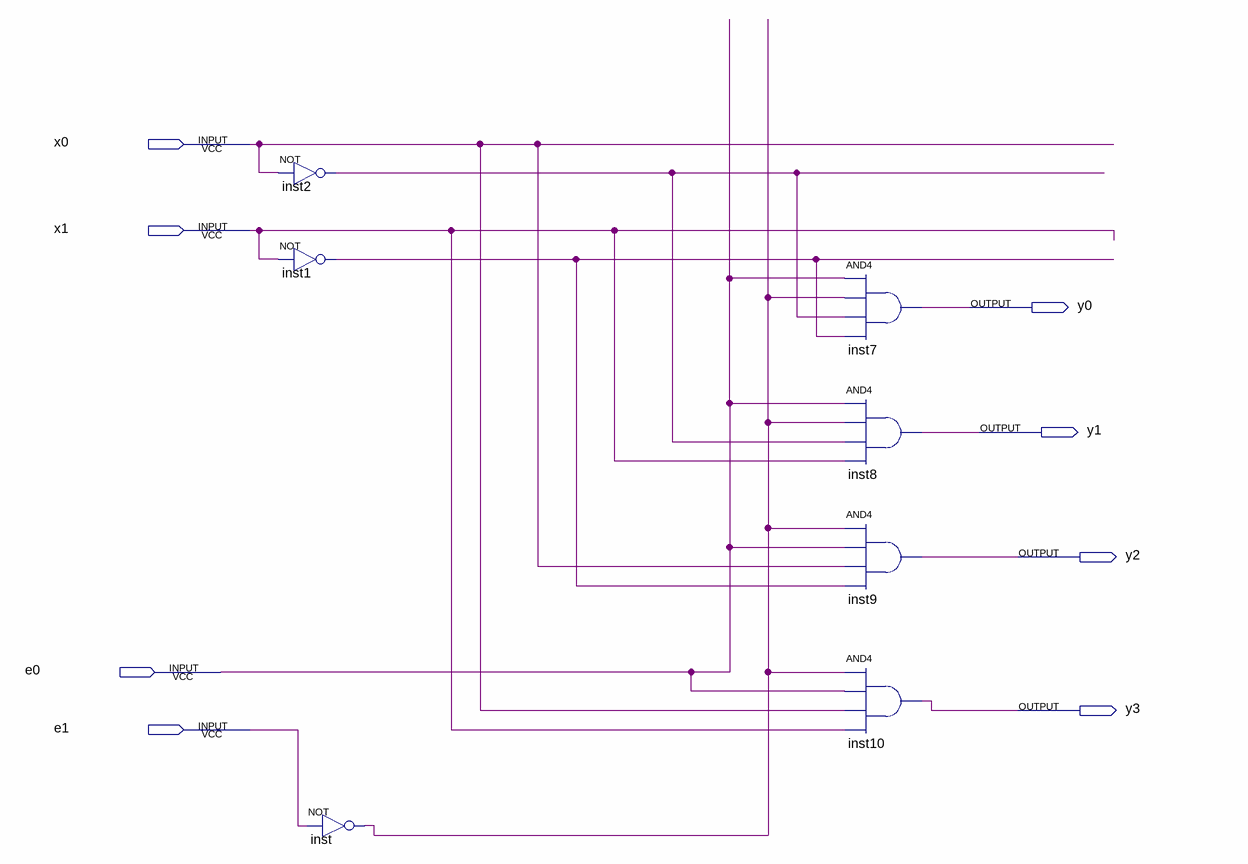
[diagram p0: schematic sheet]
// Quartus schematic 2_4dec.bdf as structural Verilog: 7 symbols, 8 pins
module \2_4dec  (
  input  x0,
  input  x1,
  input  e0,
  input  e1,
  output y0,
  output y1,
  output y2,
  output y3
);

  wire inst1_out, inst2_out, inst_out;

  not inst2 (inst2_out, x0);
  not inst1 (inst1_out, x1);
  not inst (inst_out, e1);
  and inst7 (y0, e0, inst_out, inst2_out, inst1_out);
  and inst8 (y1, e0, inst_out, inst2_out, x1);
  and inst9 (y2, inst_out, e0, x0, inst1_out);
  and inst10 (y3, inst_out, e0, x0, x1);
endmodule
